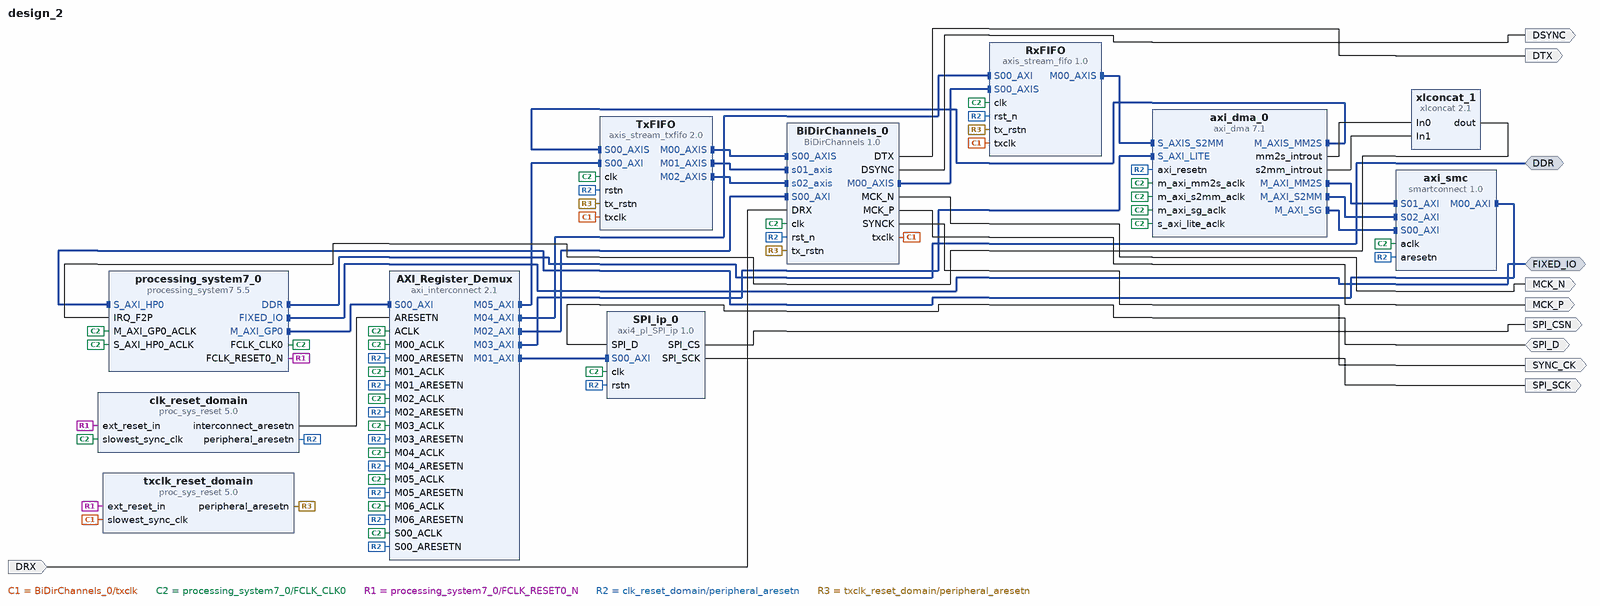
[diagram p0: block diagram of the top level]
# Vivado block design design_2, xc7z020clg484-1, Vivado 2021.2
create_bd_design design_2

create_bd_intf_port -mode Master -vlnv xilinx.com:interface:ddrx_rtl:1.0 DDR
create_bd_intf_port -mode Master -vlnv xilinx.com:display_processing_system7:fixedio_rtl:1.0 FIXED_IO
create_bd_port -dir O -type data SPI_SCK
create_bd_port -dir O -type data SPI_CSN
create_bd_port -dir I -type data DRX
create_bd_port -dir O -type data DSYNC
create_bd_port -dir O -type data DTX
create_bd_port -dir IO -type data SPI_D
create_bd_port -dir O -type clk SYNC_CK
create_bd_port -dir O -type clk MCK_N
create_bd_port -dir O -type clk MCK_P

create_bd_cell -type ip -vlnv xilinx.com:ip:axi_interconnect:2.1 AXI_Register_Demux
set_property -dict {CONFIG.NUM_MI 7} [get_bd_cells AXI_Register_Demux]
create_bd_cell -type ip -vlnv xilinx.com:ip:xlconcat:2.1 xlconcat_1
create_bd_cell -type ip -vlnv xilinx.com:ip:axi_dma:7.1 axi_dma_0
set_property -dict {CONFIG.c_sg_include_stscntrl_strm 0} [get_bd_cells axi_dma_0]
create_bd_cell -type ip -vlnv xilinx.com:user:axi4_pl_SPI_ip:1.0 SPI_ip_0
create_bd_cell -type ip -vlnv xilinx.com:ip:proc_sys_reset:5.0 txclk_reset_domain
create_bd_cell -type ip -vlnv xilinx.com:ip:proc_sys_reset:5.0 clk_reset_domain
create_bd_cell -type ip -vlnv xilinx.com:ip:processing_system7:5.5 processing_system7_0
set_property -dict [list \
  CONFIG.PCW_APU_PERIPHERAL_FREQMHZ 666.666667 \
  CONFIG.PCW_ENET0_ENET0_IO {MIO 16 .. 27} \
  CONFIG.PCW_ENET0_GRP_MDIO_ENABLE 1 \
  CONFIG.PCW_ENET0_GRP_MDIO_IO {MIO 52 .. 53} \
  CONFIG.PCW_ENET0_PERIPHERAL_ENABLE 1 \
  CONFIG.PCW_ENET0_RESET_ENABLE 0 \
  CONFIG.PCW_ENET_RESET_ENABLE 1 \
  CONFIG.PCW_ENET_RESET_SELECT {Share reset pin} \
  CONFIG.PCW_FPGA0_PERIPHERAL_FREQMHZ 100.000000 \
  CONFIG.PCW_FPGA1_PERIPHERAL_FREQMHZ 150.000000 \
  CONFIG.PCW_GPIO_MIO_GPIO_ENABLE 1 \
  CONFIG.PCW_GPIO_MIO_GPIO_IO MIO \
  CONFIG.PCW_I2C_RESET_ENABLE 1 \
  CONFIG.PCW_IRQ_F2P_INTR 1 \
  CONFIG.PCW_PERIPHERAL_BOARD_PRESET part0 \
  CONFIG.PCW_PRESET_BANK1_VOLTAGE {LVCMOS 1.8V} \
  CONFIG.PCW_QSPI_GRP_SINGLE_SS_ENABLE 1 \
  CONFIG.PCW_QSPI_GRP_SINGLE_SS_IO {MIO 1 .. 6} \
  CONFIG.PCW_QSPI_PERIPHERAL_ENABLE 1 \
  CONFIG.PCW_QSPI_QSPI_IO {MIO 1 .. 6} \
  CONFIG.PCW_SD0_GRP_CD_ENABLE 1 \
  CONFIG.PCW_SD0_GRP_CD_IO {MIO 47} \
  CONFIG.PCW_SD0_GRP_WP_ENABLE 1 \
  CONFIG.PCW_SD0_GRP_WP_IO {MIO 46} \
  CONFIG.PCW_SD0_PERIPHERAL_ENABLE 1 \
  CONFIG.PCW_SD0_SD0_IO {MIO 40 .. 45} \
  CONFIG.PCW_SDIO_PERIPHERAL_FREQMHZ 50 \
  CONFIG.PCW_SINGLE_QSPI_DATA_MODE x4 \
  CONFIG.PCW_TTC0_PERIPHERAL_ENABLE 1 \
  CONFIG.PCW_TTC0_TTC0_IO EMIO \
  CONFIG.PCW_UART1_PERIPHERAL_ENABLE 1 \
  CONFIG.PCW_UART1_UART1_IO {MIO 48 .. 49} \
  CONFIG.PCW_UART_PERIPHERAL_FREQMHZ 50 \
  CONFIG.PCW_UIPARAM_DDR_FREQ_MHZ 533.333313 \
  CONFIG.PCW_UIPARAM_DDR_PARTNO {MT41J128M16 HA-15E} \
  CONFIG.PCW_USB0_PERIPHERAL_ENABLE 1 \
  CONFIG.PCW_USB0_RESET_ENABLE 0 \
  CONFIG.PCW_USB0_USB0_IO {MIO 28 .. 39} \
  CONFIG.PCW_USB_RESET_ENABLE 1 \
  CONFIG.PCW_USB_RESET_SELECT {Share reset pin} \
  CONFIG.PCW_USE_FABRIC_INTERRUPT 1 \
  CONFIG.PCW_USE_S_AXI_HP0 1 \
  CONFIG.preset ZedBoard \
] [get_bd_cells processing_system7_0]
# 513 more settings of processing_system7_0 are not shown: defaults, MIO pin electricals, DDR timing, and values the tool derives
create_bd_cell -type ip -vlnv xilinx.com:ip:smartconnect:1.0 axi_smc
set_property -dict {CONFIG.NUM_SI 3} [get_bd_cells axi_smc]
create_bd_cell -type ip -vlnv xilinx.com:user:axis_stream_fifo:1.0 RxFIFO
create_bd_cell -type ip -vlnv user.org:user:axis_stream_txfifo:2.0 TxFIFO
set_property -dict {CONFIG.ADDR_WIDTH 11} [get_bd_cells TxFIFO]
create_bd_cell -type ip -vlnv xilinx.com:user:BiDirChannels:1.0 BiDirChannels_0

# ---- connections ----

connect_bd_intf_net [get_bd_intf_pins BiDirChannels_0/M00_AXIS] [get_bd_intf_pins RxFIFO/S00_AXIS]
connect_bd_intf_net [get_bd_intf_pins TxFIFO/S00_AXIS] [get_bd_intf_pins axi_dma_0/M_AXIS_MM2S]
connect_bd_intf_net [get_bd_intf_pins axi_dma_0/M_AXI_MM2S] [get_bd_intf_pins axi_smc/S01_AXI]
connect_bd_intf_net [get_bd_intf_pins axi_dma_0/M_AXI_S2MM] [get_bd_intf_pins axi_smc/S02_AXI]
connect_bd_intf_net [get_bd_intf_pins axi_dma_0/M_AXI_SG] [get_bd_intf_pins axi_smc/S00_AXI]
connect_bd_intf_net -intf_net axis_stream_fifo_0_M00_AXIS [get_bd_intf_pins RxFIFO/M00_AXIS] [get_bd_intf_pins axi_dma_0/S_AXIS_S2MM]
connect_bd_intf_net -intf_net axis_stream_txfifo_0_M00_AXIS [get_bd_intf_pins TxFIFO/M00_AXIS] [get_bd_intf_pins BiDirChannels_0/S00_AXIS]
connect_bd_intf_net -intf_net axis_stream_txfifo_0_M01_AXIS [get_bd_intf_pins TxFIFO/M01_AXIS] [get_bd_intf_pins BiDirChannels_0/s01_axis]
connect_bd_intf_net -intf_net axis_stream_txfifo_0_M02_AXIS [get_bd_intf_pins BiDirChannels_0/s02_axis] [get_bd_intf_pins TxFIFO/M02_AXIS]
connect_bd_intf_net [get_bd_intf_ports DDR] [get_bd_intf_pins processing_system7_0/DDR]
connect_bd_intf_net [get_bd_intf_ports FIXED_IO] [get_bd_intf_pins processing_system7_0/FIXED_IO]
connect_bd_intf_net [get_bd_intf_pins processing_system7_0/M_AXI_GP0] [get_bd_intf_pins AXI_Register_Demux/S00_AXI]
connect_bd_intf_net [get_bd_intf_pins AXI_Register_Demux/M01_AXI] [get_bd_intf_pins SPI_ip_0/S00_AXI]
connect_bd_intf_net [get_bd_intf_pins AXI_Register_Demux/M02_AXI] [get_bd_intf_pins BiDirChannels_0/S00_AXI]
connect_bd_intf_net [get_bd_intf_pins AXI_Register_Demux/M03_AXI] [get_bd_intf_pins axi_dma_0/S_AXI_LITE]
connect_bd_intf_net [get_bd_intf_pins AXI_Register_Demux/M04_AXI] [get_bd_intf_pins RxFIFO/S00_AXI]
connect_bd_intf_net [get_bd_intf_pins TxFIFO/S00_AXI] [get_bd_intf_pins AXI_Register_Demux/M05_AXI]
connect_bd_intf_net -intf_net smartconnect_0_M00_AXI [get_bd_intf_pins processing_system7_0/S_AXI_HP0] [get_bd_intf_pins axi_smc/M00_AXI]
connect_bd_net -net BiDirChannels_0_HSI_DAM [get_bd_pins BiDirChannels_0/DTX] [get_bd_ports DTX]
connect_bd_net -net BiDirChannels_0_HSI_DAP [get_bd_pins BiDirChannels_0/DSYNC] [get_bd_ports DSYNC]
connect_bd_net [get_bd_pins BiDirChannels_0/MCK_N] [get_bd_ports MCK_N]
connect_bd_net [get_bd_pins BiDirChannels_0/MCK_P] [get_bd_ports MCK_P]
connect_bd_net [get_bd_pins BiDirChannels_0/SYNCK] [get_bd_ports SYNC_CK]
connect_bd_net [get_bd_pins BiDirChannels_0/txclk] \
  [get_bd_pins txclk_reset_domain/slowest_sync_clk] [get_bd_pins RxFIFO/txclk] [get_bd_pins TxFIFO/txclk]
connect_bd_net -net HSI_A0_1 [get_bd_ports DRX] [get_bd_pins BiDirChannels_0/DRX]
connect_bd_net [get_bd_ports SPI_D] [get_bd_pins SPI_ip_0/SPI_D]
connect_bd_net [get_bd_pins SPI_ip_0/SPI_CS] [get_bd_ports SPI_CSN]
connect_bd_net [get_bd_pins SPI_ip_0/SPI_SCK] [get_bd_ports SPI_SCK]
connect_bd_net [get_bd_pins axi_dma_0/mm2s_introut] [get_bd_pins xlconcat_1/In0]
connect_bd_net [get_bd_pins axi_dma_0/s2mm_introut] [get_bd_pins xlconcat_1/In1]
connect_bd_net -net proc_sys_reset_0_interconnect_aresetn [get_bd_pins clk_reset_domain/interconnect_aresetn] [get_bd_pins AXI_Register_Demux/ARESETN]
connect_bd_net [get_bd_pins processing_system7_0/FCLK_CLK0] \
  [get_bd_pins AXI_Register_Demux/ACLK] [get_bd_pins AXI_Register_Demux/S00_ACLK] [get_bd_pins AXI_Register_Demux/M00_ACLK] \
  [get_bd_pins AXI_Register_Demux/M01_ACLK] [get_bd_pins AXI_Register_Demux/M02_ACLK] \
  [get_bd_pins AXI_Register_Demux/M03_ACLK] [get_bd_pins AXI_Register_Demux/M04_ACLK] \
  [get_bd_pins AXI_Register_Demux/M05_ACLK] [get_bd_pins AXI_Register_Demux/M06_ACLK] [get_bd_pins axi_dma_0/s_axi_lite_aclk] \
  [get_bd_pins axi_dma_0/m_axi_sg_aclk] [get_bd_pins axi_dma_0/m_axi_mm2s_aclk] [get_bd_pins axi_dma_0/m_axi_s2mm_aclk] \
  [get_bd_pins SPI_ip_0/clk] [get_bd_pins clk_reset_domain/slowest_sync_clk] \
  [get_bd_pins processing_system7_0/M_AXI_GP0_ACLK] [get_bd_pins processing_system7_0/S_AXI_HP0_ACLK] \
  [get_bd_pins axi_smc/aclk] [get_bd_pins RxFIFO/clk] [get_bd_pins TxFIFO/clk] [get_bd_pins BiDirChannels_0/clk]
connect_bd_net [get_bd_pins processing_system7_0/FCLK_RESET0_N] \
  [get_bd_pins txclk_reset_domain/ext_reset_in] [get_bd_pins clk_reset_domain/ext_reset_in]
connect_bd_net -net rst_ps7_0_100M_peripheral_aresetn [get_bd_pins clk_reset_domain/peripheral_aresetn] \
  [get_bd_pins AXI_Register_Demux/S00_ARESETN] [get_bd_pins AXI_Register_Demux/M00_ARESETN] \
  [get_bd_pins AXI_Register_Demux/M01_ARESETN] [get_bd_pins AXI_Register_Demux/M02_ARESETN] \
  [get_bd_pins AXI_Register_Demux/M03_ARESETN] [get_bd_pins AXI_Register_Demux/M04_ARESETN] \
  [get_bd_pins AXI_Register_Demux/M05_ARESETN] [get_bd_pins AXI_Register_Demux/M06_ARESETN] \
  [get_bd_pins axi_dma_0/axi_resetn] [get_bd_pins SPI_ip_0/rstn] [get_bd_pins axi_smc/aresetn] [get_bd_pins RxFIFO/rst_n] \
  [get_bd_pins TxFIFO/rstn] [get_bd_pins BiDirChannels_0/rst_n]
connect_bd_net [get_bd_pins txclk_reset_domain/peripheral_aresetn] \
  [get_bd_pins RxFIFO/tx_rstn] [get_bd_pins TxFIFO/tx_rstn] [get_bd_pins BiDirChannels_0/tx_rstn]
connect_bd_net [get_bd_pins xlconcat_1/dout] [get_bd_pins processing_system7_0/IRQ_F2P]

# ---- address map ----
assign_bd_address -offset 0x00000000 -range 512M -target_address_space [get_bd_addr_spaces axi_dma_0/Data_MM2S] [get_bd_addr_segs processing_system7_0/S_AXI_HP0/HP0_DDR_LOWOCM]
assign_bd_address -offset 0x00000000 -range 512M -target_address_space [get_bd_addr_spaces axi_dma_0/Data_S2MM] [get_bd_addr_segs processing_system7_0/S_AXI_HP0/HP0_DDR_LOWOCM]
assign_bd_address -offset 0x00000000 -range 512M -target_address_space [get_bd_addr_spaces axi_dma_0/Data_SG] [get_bd_addr_segs processing_system7_0/S_AXI_HP0/HP0_DDR_LOWOCM]
assign_bd_address -offset 0x40400000 -range 64K -target_address_space [get_bd_addr_spaces processing_system7_0/Data] [get_bd_addr_segs axi_dma_0/S_AXI_LITE/Reg]
assign_bd_address -offset 0x43C10000 -range 64K -target_address_space [get_bd_addr_spaces processing_system7_0/Data] [get_bd_addr_segs SPI_ip_0/S00_AXI/S00_AXI_reg]
assign_bd_address -offset 0x43C20000 -range 64K -target_address_space [get_bd_addr_spaces processing_system7_0/Data] [get_bd_addr_segs BiDirChannels_0/S00_AXI/S00_AXI_reg]
assign_bd_address -offset 0x43C30000 -range 64K -target_address_space [get_bd_addr_spaces processing_system7_0/Data] [get_bd_addr_segs RxFIFO/S00_AXI/S00_AXI_reg]
assign_bd_address -offset 0x43C40000 -range 64K -target_address_space [get_bd_addr_spaces processing_system7_0/Data] [get_bd_addr_segs TxFIFO/S00_AXI/S00_AXI_reg]

validate_bd_design
save_bd_design
